# EAGLE design USB-DA-BUF (EAGLE 6.6.0)
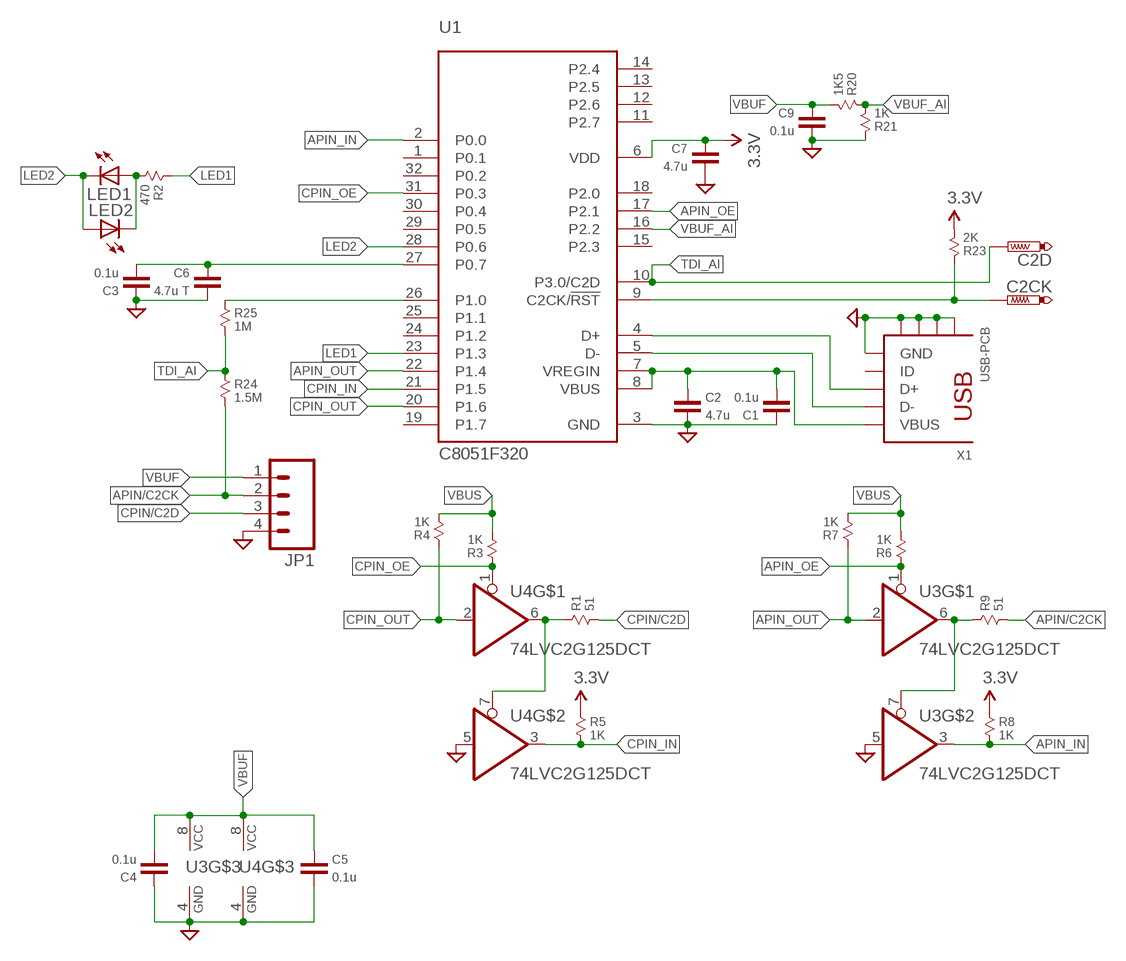
[diagram p0: schematic, sheet 1]

## Parts
C1  0.1u  CAP-0603  [0603]
C2  4.7u  CAP-0603  [0603]
C2CK  PTR1TP10R  [TP10R]
C2D  PTR1TP10R  [TP10R]
C3  0.1u  CAP-0603  [0603]
C4  0.1u  CAP-0603  [0603]
C5  0.1u  CAP-0603  [0603]
C6  4.7u T  CAP-0603  [0603]
C7  4.7u  CAP-0603  [0603]
C9  0.1u  CAP-0603  [0603]
JP1  M04PTH  [1X04]
LED1  LED0603  [LED-0603]
LED2  LED0603  [LED-0603]
R1  51  RESISTOR-0603  [0603]
R2  470  RESISTOR-0603  [0603]
R3  1K  RESISTOR-0603  [0603]
R4  1K  RESISTOR-0603  [0603]
R5  1K  RESISTOR-0603  [0603]
R6  1K  RESISTOR-0603  [0603]
R7  1K  RESISTOR-0603  [0603]
R8  1K  RESISTOR-0603  [0603]
R9  51  RESISTOR-0603  [0603]
R20  1K5  RESISTOR-0603  [0603]
R21  1K  RESISTOR-0603  [0603]
R23  2K  RESISTOR-0603  [0603]
R24  1.5M  RESISTOR-0603  [0603]
R25  1M  RESISTOR-0603  [0603]
U1  C8051F320  [LQFP32]
U3  74LVC2G125DCT  [SSOP08]
U4  74LVC2G125DCT  [SSOP08]
X1  USB-PCB  USB-SMD  [USB-MINIB]

## Nets
3.3V: C7.2 R5.1 R8.1 R23.2 U1.6(VDD)
APIN/C2CK: JP1.2 R9.2 R24.2
APIN_IN: R8.2 U1.2(P0.0) U3.3(O)
APIN_OE: R6.1 U1.17(P2.1) U3.1(OE)
APIN_OUT: R7.1 U1.22(P1.4) U3.2(I)
CPIN/C2D: JP1.3 R1.2
CPIN_IN: R5.2 U1.21(P1.5) U4.3(O)
CPIN_OE: R3.1 U1.31(P0.3) U4.1(OE)
CPIN_OUT: R4.1 U1.20(P1.6) U4.2(I)
GND: C1.2 C2.1 C3.2 C4.2 C5.1 C6.1 C7.1 C9.1 JP1.4 R21.1 U1.3(GND) U3.4(GND) U3.5(I) U4.4(GND) U4.5(I) X1.GND X1.GND@1(GND) X1.GND@2(GND) X1.GND@3(GND) X1.GND@4(GND)
LED1: R2.1 U1.23(P1.3)
LED2: LED1.C LED2.A U1.28(P0.6)
N$1: U1.4(D+) X1.D+
N$2: U1.5(D-) X1.D-
N$7: R1.1 U4.6(O) U4.7(OE)
N$9: LED1.A LED2.C R2.2
N$12: R9.1 U3.6(O) U3.7(OE)
P0.7: C3.1 C6.2 U1.27(P0.7)
P1.0: R25.1 U1.26(P1.0)
RST: C2CK.TP R23.1 U1.9(C2CK/!RST)
TDI_AI: C2D.TP R24.1 R25.2 U1.10(P3.0/C2D)
VBUF: C4.1 C5.2 C9.2 JP1.1 R20.2 U3.8(VCC) U4.8(VCC)
VBUF_AI: R20.1 R21.2 U1.16(P2.2)
VBUS: C1.1 C2.2 R3.2 R4.2 R6.2 R7.2 U1.7(VREGIN) U1.8(VBUS) X1.VBUS
Unconnected: U1.1(P0.1) U1.11(P2.7) U1.12(P2.6) U1.13(P2.5) U1.14(P2.4) U1.15(P2.3) U1.18(P2.0) U1.19(P1.7) U1.24(P1.2) U1.25(P1.1) U1.29(P0.5) U1.30(P0.4) U1.32(P0.2) X1.ID

## Library data of the parts
C1-C7 C9 = X893:CAP: Capacitor
C2CK C2D = testpad:PTR1: TEST PIN
JP1 = SparkFun:M04: Header 4 Standard 4-pin 0.1" header. Use with straight break away headers (SKU : PRT-00116), right angle break away headers (PRT-00553), swiss pins (PRT-00743), machine pins (PRT-00117), and female headers (PRT-00115). Molex polarized connector foot print use with SKU : PRT-08231 with associated crimp pins and housings.
LED1 LED2 = SparkFun:LED: LEDs Standard schematic elements and footprints for 5mm, 3mm, 1206, and 0603 sized LEDs. 5mm - Spark Fun Electronics SKU : COM-00529 (and others)
R1-R9 R20 R21 R23-R25 = X893:RESISTOR
U1 = X893:C8051F320: http://www.keil.com/dd/docs/datashts/silabs/c8051f32x.pdf
U3 U4 = 74xx-little-de:74*2G125: Dual line drivers with 3-state outputs.
X1 = X893:USB: USB Connectors USB-B-PTH is fully proven SKU : PRT-00139 USB-miniB is fully proven SKU : PRT-00587 USB-A-PCB is untested. USB-A-H is throughly reviewed, but untested. Spark Fun Electronics SKU : PRT-00437 USB-B-SMT is throughly reviewed, but untested. Needs silkscreen touching up. USB-A-S has not been used/tested USB-MB-H has not been used/tested

## Board
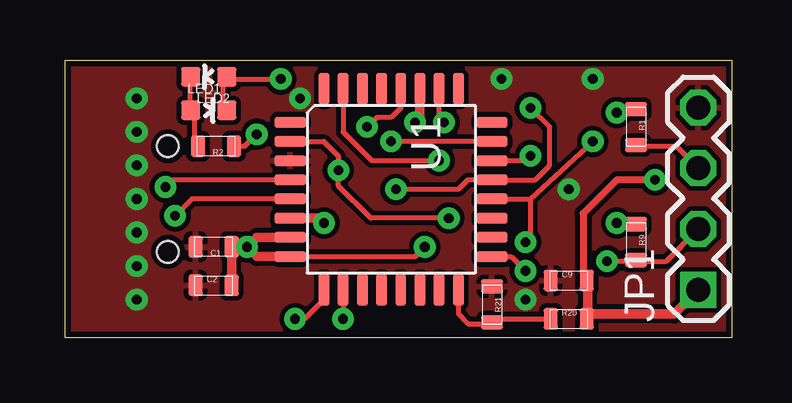
[diagram p1: board, top side]
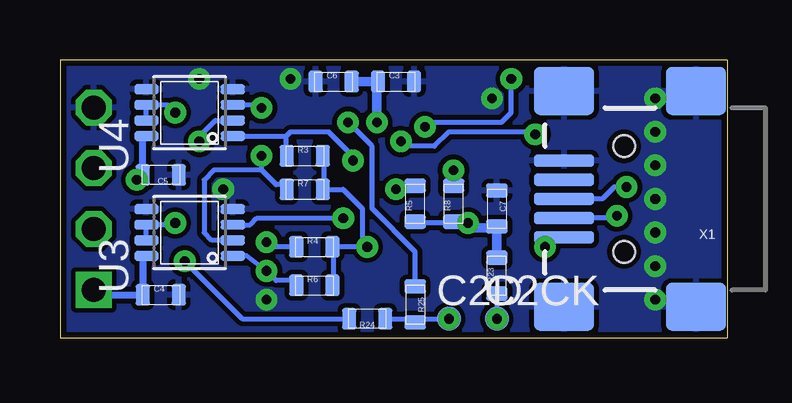
[diagram p2: board, bottom side, seen from below]

Size 27.8 x 11.6 mm. Coordinates in mm from the lower left corner, seen from the top.
Outline: 0,11.6 27.8,11.6 27.8,0 0,0 0,11.6
Copper layers (1+16): Top 0.035mm / dielectric 1.5mm / Bottom 0.035mm
Design rules "Rezonit": minimum track width 0.2mm, minimum drill 0.4mm, track to track 0.2mm, track to pad 0.2mm, pad to pad 0.2mm, via to via 0.2mm, smd to smd 0mil, copper to edge 0.25mm, drill to drill 0.4mm, minimum pad ring 0.25mm, minimum via ring 0.25mm, stop-mask expansion 4mil, vias tented up to drill 0.4mm, thermal gap 0.2mm

### Footprints (pad centres in the part's own frame; a part is rotated, then mirrored left to right if it is on the bottom)
0603 = smd 0.6 x 0.9: 1 -0.75,0; 2 0.75,0
TP10R = smd 1 x 1: TP 0,0
1X04 = drill 1 pad 1.5 square: 1 0,0 | drill 1 pad 1.5 octagon: 2 2.54,0; 3 5.08,0; 4 7.62,0
LED-0603 = smd 0.8 x 0.8: A 0,-0.75; C 0,0.75
LQFP32 = smd 0.45 x 1.3: 1 -2.8,-4.2; 2 -2,-4.2; 3 -1.2,-4.2; 4 -0.4,-4.2; 5 0.4,-4.2; 6 1.2,-4.2; 7 2,-4.2; 8 2.8,-4.2; 17 2.8,4.2; 18 2,4.2; 19 1.2,4.2; 20 0.4,4.2; 21 -0.4,4.2; 22 -1.2,4.2; 23 -2,4.2; 24 -2.8,4.2 | smd 1.3 x 0.45: 9 4.2,-2.8; 10 4.2,-2; 11 4.2,-1.2; 12 4.2,-0.4; 13 4.2,0.4; 14 4.2,1.2; 15 4.2,2; 16 4.2,2.8; 25 -4.2,2.8; 26 -4.2,2; 27 -4.2,1.2; 28 -4.2,0.4; 29 -4.2,-0.4; 30 -4.2,-1.2; 31 -4.2,-2; 32 -4.2,-2.8
SSOP08 = smd 0.4 x 1: 1 -0.975,-1.8; 2 -0.325,-1.8; 3 0.325,-1.8; 4 0.975,-1.8; 5 0.975,1.8; 6 0.325,1.8; 7 -0.325,1.8; 8 -0.975,1.8
USB-MINIB = smd 2.5 x 0.5: D+ 2.5,0; D- 2.5,0.8; GND 2.5,-1.6; ID 2.5,-0.8; VBUS 2.5,1.6 | smd 2.5 x 2: GND@1 -3,-4.5; GND@2 -3,4.5; GND@3 2.5,4.5; GND@4 2.5,-4.5 | hole 0.9: 0,2.2; 0,-2.2

### Placement (x,y rotation side)
C1  6.2,3.8 180 top
C2  6.2,2.2 0 top
C2CK  9.6,0.8 0 bottom
C2D  11.6,0.8 0 bottom
C3  13.8,10.7 0 bottom
C4  23.6,1.8 0 bottom
C5  23.6,6.8 180 bottom
C6  16.4,10.7 0 bottom
C7  9.6,5.4 270 bottom
C9  21,2.4 0 top
JP1  26.4,2 90 top
LED1  6,9.5 270 top
LED2  6,10.9 90 top
R1  23.8,8.8 270 top
R2  6.3,8 180 top
R3  17.6,7.6 0 bottom
R4  17.2,3.8 0 bottom
R5  13,5.6 90 bottom
R6  17.2,2.2 0 bottom
R7  17.6,6.2 0 bottom
R8  11.4,5.6 90 bottom
R9  23.8,4 270 top
R20  21,0.8 0 top
R21  17.8,1.4 270 top
R23  9.6,2.6 90 bottom
R24  15,0.8 180 bottom
R25  13,1.4 270 bottom
U1  13.6,6.2 270 top
U3  22.4,4.4 90 bottom
U4  22.4,9.4 90 bottom
X1  4.3,5.8 180 bottom

### Tracks (layer width: path | path; a pad name or v marks a point on that pad's centre or on a via)
3.3V  (via drill 0.4)
  Top 0.4: U1.6 10.6,5 v10.8,4.8
  Bottom 0.2: 11.4,4.8 v10.8,4.8 | R8.1 11.4,4.8 | 11.4,4.8 12.95,4.8 R5.1
  Bottom 0.4: C7.2 9.6,4.6 | 9.6,4.6 R23.2 | 9.6,4.6 10.6,4.6 v10.8,4.8
APIN/C2CK  (via drill 0.4)
  Top 0.2: 23.8,3.2 v22.6,3.2 | R9.2 23.8,3.2 | 23.8,3.2 25.06,3.2 JP1.2
  Bottom 0.2: v22.6,3.2 20.2,0.8 R24.2
APIN_IN  (via drill 0.4)
  Top 0.2: U1.2 10.8,8.2 11.4,7.6 v11.4,7 R8.2 12.75,5 v16,5
  Bottom 0.2: R8.2 v11.4,7 | U3.3 19.88,4.72 19.6,5 v16,5
APIN_OE  (via drill 0.4)
  Top 0.2: U1.17 18.6,3.4 v19.2,2.8
  Bottom 0.2: R6.1 18.2,2.4 18.8,2.4 v19.2,2.8 20.02,3.42 U3.1
APIN_OUT  (via drill 0.4)
  Top 0.2: U1.22 19.2,7.4 v19.4,7.6
  Bottom 0.2: R7.1 18.35,6.35 18.4,6.4 18.8,6.4 19.4,7 | 19.4,7 v19.4,7.6 | 19.4,7 21.4,7 21.8,6.6 21.8,4.4 21.48,4.08 U3.2
CPIN/C2D
  Top 0.2: R1.2 23.8,8 25.48,8 JP1.3
CPIN_IN  (via drill 0.4)
  Top 0.2: v19.4,9.6 20.2,8.8 20.2,7.2 19.6,6.6 U1.21 16.8,6.6 16.4,6.2 v13.8,6.2
  Bottom 0.2: v19.4,9.6 19.48,9.72 U4.3 | R5.2 13,6.4 13.6,6.4 v13.8,6.2
CPIN_OE  (via drill 0.4)
  Top 0.2: U1.31 11.6,8.6 12.8,7.4 v15.6,7.4
  Bottom 0.2: U4.1 18.38,8.43 | 18.38,8.43 18.4,8.4 18.4,7.8 R3.1 | v15.6,7.4 15.6,7.6 16.6,8.6 18.2,8.6 18.38,8.43
CPIN_OUT  (via drill 0.4)
  Top 0.2: U1.20 19.4,5.8 | 19.4,5.8 v22,8.2 | 19.4,5.8 19.4,4.2 v19.2,4
  Bottom 0.2: v22,8.2 22,8.4 21.32,9.07 U4.2 | R4.1 19,3.8 v19.2,4
GND  (via drill 0.4)
  other vias: 21,6.2 9.8,10 18.2,10.8 22,10.8 3,7.2 3,5.8 3,4.4 3,8.6 3,3 3,10 3,1.6 19.2,1.6
  pour Bottom (isolate 0.2): 0,11.6 27.8,11.6 27.8,0 0,0
  pour Top (isolate 0.2): 0,11.6 27.8,11.6 27.8,0 0,0
LED1  (via drill 0.4)
  Top 0.2: U1.23 v13.6,8.2 | R2.1 7.5,8 v8,8.5
  Bottom 0.2: v13.6,8.2 13.4,8 12.2,8 11.6,8.6 8.1,8.6 v8,8.5
LED2  (via drill 0.4)
  Top 0.2: LED1.C 6.75,9.65 6.6,9.6 6.6,10.8 | 6.6,10.8 6.6,10.85 LED2.A | U1.28 14,9.6 13.6,9.2 13,9.2 v12.6,8.8 | 6.6,10.8 v9,10.8
  Bottom 0.2: v12.6,8.8 12.4,9 9.4,9 9,9.4 v9,10.8
N$1  (via drill 0.4)
  Top 0.2: U1.4 4.5,6.6 v4.2,6.3
  Bottom 0.2: v4.2,6.3 4.7,6.3 5.2,5.8 X1.D+
N$2  (via drill 0.4)
  Top 0.2: U1.5 5.3,5.8 v4.6,5.1
  Bottom 0.2: v4.6,5.1 4.7,5 X1.D-
N$7  (via drill 0.4)
  Top 0.2: R1.1 23.75,9.4 v23,9.4
  Bottom 0.2: v23,9.4 23.32,9.72 U4.6 U4.7
N$9
  Top 0.2: LED2.C 5.25,10.85 5.2,10.8 5.2,9.55 LED1.A 5.45,9.45 5.4,9.4 5.4,8.05 R2.2
N$12  (via drill 0.4)
  Top 0.2: R9.1 23.8,4.8 v23,4.8
  Bottom 0.2: v23,4.8 23.07,4.72 U3.6 U3.7
P0.7  (via drill 0.4)
  Top 0.4: U1.27 14.8,9.2 v14.6,9
  Bottom 0.4: 14.6,10.6 14.6,10.7 C6.2 | C3.1 14.55,10.65 14.6,10.6 | 14.6,10.6 v14.6,9
P1.0  (via drill 0.4)
  Top 0.2: v15.8,9 15.6,9.2 U1.26
  Bottom 0.2: R25.1 13,3.6 14.8,5.4 14.8,8 v15.8,9
RST  (via drill 0.4)
  Top 0.2: U1.9 10.8,1.6 10,0.8 C2CK.TP
  Bottom 0.2: 9.6,1.2 C2CK.TP R23.1
  other vias: 9.6,0.8
TDI_AI  (via drill 0.4)
  Top 0.2: U1.10 C2D.TP
  Bottom 0.2: R24.1 13.05,0.8 13.05,0.7 R25.2 13,0.8 C2D.TP
  other vias: 11.6,0.8
VBUF  (via drill 0.4)
  Top 0.2: R20.2 21.8,1 | 21.8,2.35 C9.2
  Top 0.3: v24.6,6.6 23,6.6 21.6,5.2 21.6,2.8 21.8,2.6
  Top 0.4: 21.8,2.35 21.8,1 25.4,1 JP1.1 | 21.8,2.6 21.8,2.45 C9.2
  Bottom 0.3: 26.2,1.8 C4.1 24.35,3.42 U3.8 | U4.8 24.35,8.43 C5.2 v24.6,6.6
  Bottom 0.4: JP1.1 26.2,1.8
VBUF_AI
  Top 0.2: U1.16 16.4,1 16.8,0.6 17.75,0.6 R21.2 17.8,0.8 R20.1
VBUS  (via drill 0.4)
  Top 0.2: U1.8 14.6,3.4 v15,3.8
  Top 0.4: C2.2 C1.1 v7.6,3.8 | 7.75,3.65 v7.6,3.8 | U1.8 8,3.4 v7.6,3.8 | U1.7 8,4.2 v7.6,3.8
  Bottom 0.2: R6.2 16.4,2.2 16.4,3.8 | 16.4,3.8 16.4,4 R4.2 | 16.8,6.2 16.8,7.55 R3.2 | 16.4,3.8 v15,3.8 15.2,4 15.2,5.4 16,6.2 16.8,6.2 | R7.2 16.8,6.2
  Bottom 0.4: X1.VBUS 7.6,4.2 v7.6,3.8

### Text on the board
Reference: GND | CPIN/C2D | APIN/C2CK | VBUF